# Altium schematic sheet 底层驱动板.SchDoc
size A3; SheetNumber: 1; SheetTotal: 1
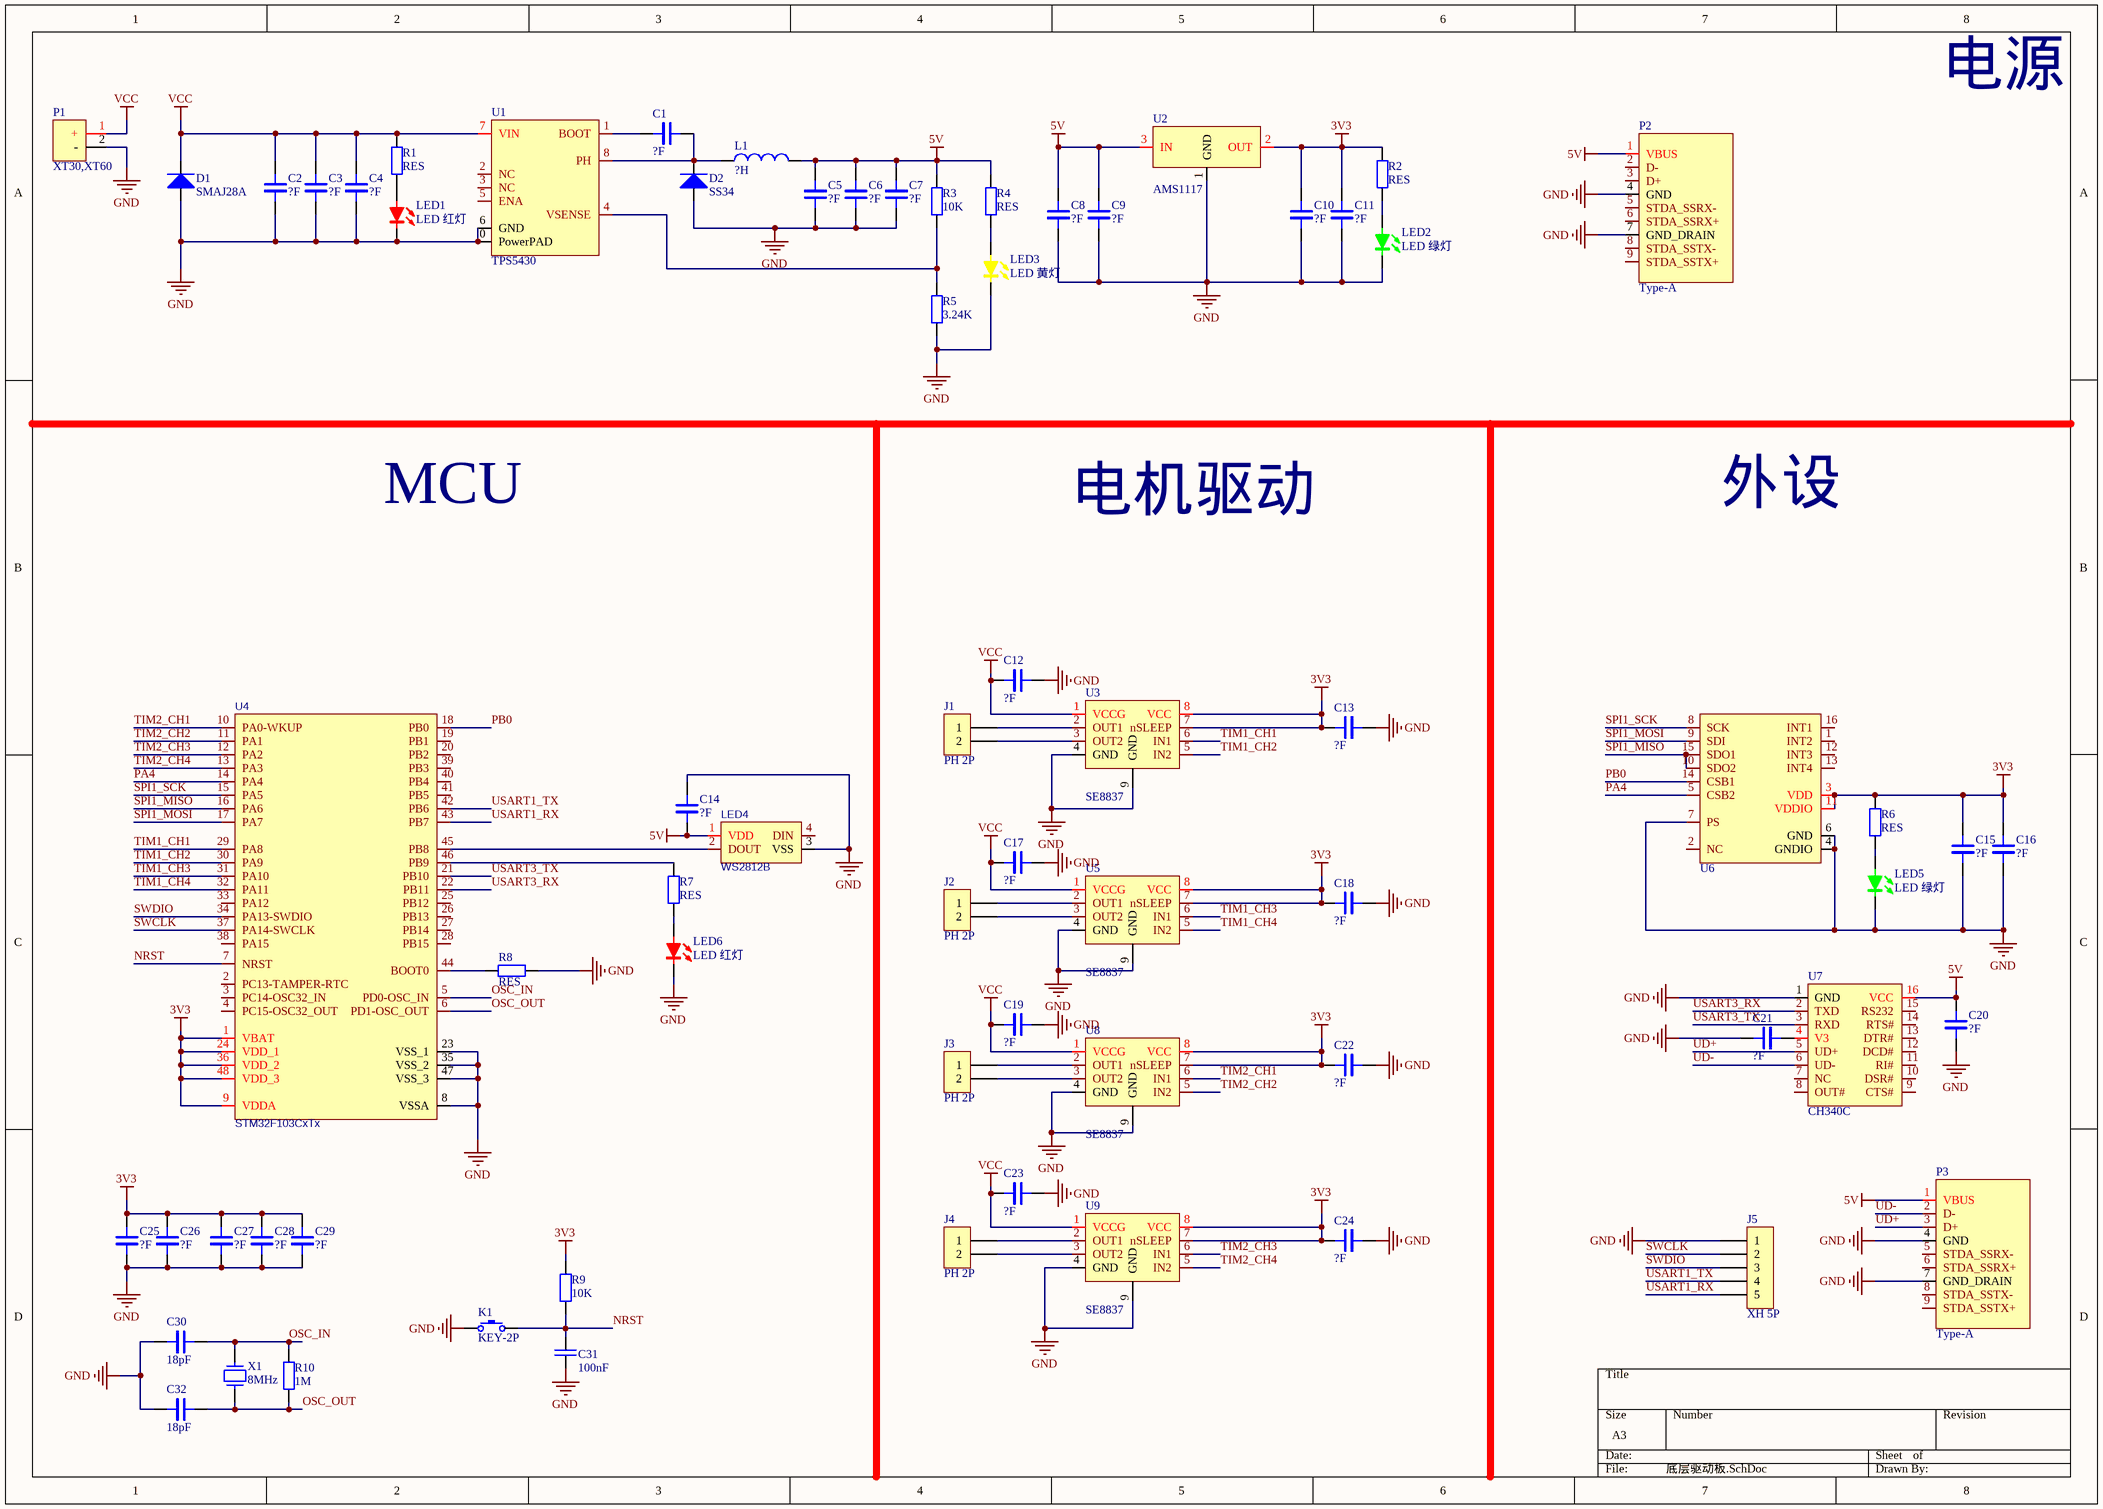
[diagram p0: 底层驱动板.SchDoc]

## Parts
C1  ?F  [C 0603]
C2  ?F  [C 1206]
C3  ?F  [C 1206]
C4  ?F  [C 0603]
C5  ?F  [C 1206]
C6  ?F  [C 1206]
C7  ?F  [C 0603]
C8  ?F  [C 1206]
C9  ?F  [C 1206]
C10  ?F  [C 1206]
C11  ?F  [C 1206]
C12  ?F  [C 1206]
C13  ?F  [C 0603]
C14  ?F  [C 0603]
C15  ?F  [C 0603]
C16  ?F  [C 0603]
C17  ?F  [C 1206]
C18  ?F  [C 0603]
C19  ?F  [C 1206]
C20  ?F  [C 0603]
C21  ?F  [C 0603]
C22  ?F  [C 0603]
C23  ?F  [C 1206]
C24  ?F  [C 0603]
C25  ?F  [C 0603]
C26  ?F  [C 0603]
C27  ?F  [C 0603]
C28  ?F  [C 0603]
C29  ?F  [C 0603]
C30  18pF  [C 0603]
C31  100nF  [C 0603]
C32  18pF  [C 0603]
D1  SMAJ28A  [SMA]
D2  SS34  [SMA]
J1  PH 2P  [PH2.0 S-W-2P]
J2  PH 2P  [PH2.0 S-W-2P]
J3  PH 2P  [PH2.0 S-W-2P]
J4  PH 2P  [PH2.0 S-W-2P]
J5  XH 5P  [XH2.54-5P_H]
K1  KEY-2P  [*SW-按键]
L1  ?H  [SMD 7*7*4]
LED1  LED 红灯  [LED 0603-R]
LED2  LED 绿灯  [LED 0603-G]
LED3  LED 黄灯  [LED 0603-Y]
LED4  WS2812B  [*WS2812B-3535]
LED5  LED 绿灯  [LED 0603-G]
LED6  LED 红灯  [LED 0603-R]
P1  XT30,XT60  [*XT30PW-M]
P2  Type-A  [*Type-A 母 弯插]
P3  Type-A  [*Type-A 母 弯插]
R1  RES  [R 0603]
R2  RES  [R 0603]
R3  10K  [R 0603]
R4  RES  [R 0603]
R5  3.24K  [R 0603]
R6  RES  [R 0603]
R7  RES  [R 0603]
R8  RES  [R 0603]
R9  10K  [R 0603]
R10  1M  [R 0603]
U1  TPS5430  [SOP8-EP]
U2  AMS1117  [SOT223]
U3  SE8837  [*DFN-8-EP]
U4  STM32F103CxTx  [LQFP48 7X7]
U5  SE8837  [*DFN-8-EP]
U6  BMI088  [*LGA-16]  (value not drawn)
U7  CH340C  [SOP16]
U8  SE8837  [*DFN-8-EP]
U9  SE8837  [*DFN-8-EP]
X1  8MHz  [XTAL SMD-2P]

## Nets
3V3: C10.2 C11.2 C13.2 C15.2 C16.2 C18.2 C22.2 C24.2 C25.2 C26.2 C27.2 C28.2 C29.2 R2.2 R6.2 R9.2 U2.2(OUT) U3.7(nSLEEP) U3.8(VCC) U4.1(VBAT) U4.9(VDDA) U4.24(VDD_1) U4.36(VDD_2) U4.48(VDD_3) U5.7(nSLEEP) U5.8(VCC) U6.3(VDD) U6.11(VDDIO) U8.7(nSLEEP) U8.8(VCC) U9.7(nSLEEP) U9.8(VCC)
5V: C5.2 C6.2 C7.2 C8.2 C9.2 C14.2 C20.2 L1.2 LED4.1(VDD) P2.1(VBUS) P3.1(VBUS) R3.2 R4.2 U2.3(IN) U7.16(VCC)
GND: C2.1 C3.1 C4.1 C5.1 C6.1 C7.1 C8.1 C9.1 C10.1 C11.1 C12.1 C13.1 C14.1 C15.1 C16.1 C17.1 C18.1 C19.1 C20.1 C21.1 C22.1 C23.1 C24.1 C25.1 C26.1 C27.1 C28.1 C29.1 C30.1 C31.2 C32.1 D1.1(A) D2.1 J5.1 K1.1 LED1.2(C) LED2.2(C) LED3.2(C) LED4.3(VSS) LED5.2(C) LED6.2(C) P1.2(-) P2.4(GND) P2.7(GND_DRAIN) P3.4(GND) P3.7(GND_DRAIN) R5.1 R8.2 U1.0(PowerPAD) U1.6(GND) U2.1(GND) U3.4(GND) U3.9(GND) U4.8(VSSA) U4.23(VSS_1) U4.35(VSS_2) U4.47(VSS_3) U5.4(GND) U5.9(GND) U6.4(GNDIO) U6.6(GND) U6.7(PS) U7.1(GND) U8.4(GND) U8.9(GND) U9.4(GND) U9.9(GND)
VCC: C2.2 C3.2 C4.2 C12.2 C17.2 C19.2 C23.2 D1.2(K) P1.1(+) R1.2 U1.7(VIN) U3.1(VCCG) U5.1(VCCG) U8.1(VCCG) U9.1(VCCG)
NRST: C31.1 K1.2 R9.1 U4.7(NRST)
OSC_IN: C30.2 R10.1 U4.5(PD0-OSC_IN) X1.1
OSC_OUT: C32.2 R10.2 U4.6(PD1-OSC_OUT) X1.2
PA4: U4.14(PA4) U6.5(CSB2)
PB0: U4.18(PB0) U6.14(CSB1)
SPI1_MISO: U4.16(PA6) U6.10(SDO2) U6.15(SDO1)
SPI1_MOSI: U4.17(PA7) U6.9(SDI)
SPI1_SCK: U4.15(PA5) U6.8(SCK)
SWCLK: J5.2 U4.37(PA14-SWCLK)
SWDIO: J5.3 U4.34(PA13-SWDIO)
TIM1_CH1: U3.6(IN1) U4.29(PA8)
TIM1_CH2: U3.5(IN2) U4.30(PA9)
TIM1_CH3: U4.31(PA10) U5.6(IN1)
TIM1_CH4: U4.32(PA11) U5.5(IN2)
TIM2_CH1: U4.10(PA0-WKUP) U8.6(IN1)
TIM2_CH2: U4.11(PA1) U8.5(IN2)
TIM2_CH3: U4.12(PA2) U9.6(IN1)
TIM2_CH4: U4.13(PA3) U9.5(IN2)
UD+: P3.3(D+) U7.5(UD+)
UD-: P3.2(D-) U7.6(UD-)
USART1_RX: J5.5 U4.43(PB7)
USART1_TX: J5.4 U4.42(PB6)
USART3_RX: U4.22(PB11) U7.2(TXD)
USART3_TX: U4.21(PB10) U7.3(RXD)
NetC1_1: C1.1 U1.1(BOOT)
NetC1_2: C1.2 D2.2 L1.1 U1.8(PH)
NetC21_2: C21.2 U7.4(V3)
NetJ1_1: J1.1 U3.2(OUT1)
NetJ1_2: J1.2 U3.3(OUT2)
NetJ2_1: J2.1 U5.2(OUT1)
NetJ2_2: J2.2 U5.3(OUT2)
NetJ3_1: J3.1 U8.2(OUT1)
NetJ3_2: J3.2 U8.3(OUT2)
NetJ4_1: J4.1 U9.2(OUT1)
NetJ4_2: J4.2 U9.3(OUT2)
NetLED1_1: LED1.1(A) R1.1
NetLED2_1: LED2.1(A) R2.1
NetLED3_1: LED3.1(A) R4.1
NetLED4_2: LED4.2(DOUT) U4.45(PB8)
NetLED5_1: LED5.1(A) R6.1
NetLED6_1: LED6.1(A) R7.2
NetR3_1: R3.1 R5.2 U1.4(VSENSE)
NetR7_1: R7.1 U4.46(PB9)
NetR8_1: R8.1 U4.44(BOOT0)

Not connected (* = marked no-connect by the designer): LED4 4(DIN); P2 2(D-) 3(D+) 5(STDA_SSRX-) 6(STDA_SSRX+) 8(STDA_SSTX-) 9(STDA_SSTX+); P3 5(STDA_SSRX-) 6(STDA_SSRX+) 8(STDA_SSTX-) 9(STDA_SSTX+); U1 2(NC) 3(NC) 5(ENA); U4 2(PC13-TAMPER-RTC) 3(PC14-OSC32_IN) 4(PC15-OSC32_OUT) 19(PB1) 20(PB2) 25(PB12) 26(PB13) 27(PB14) 28(PB15) 33(PA12) 38(PA15) 39(PB3) 40(PB4) 41(PB5); U6 1(INT2) 2(NC) 12(INT3) 13(INT4) 16(INT1); U7 7(NC) 8(OUT#) 9(CTS#) 10(DSR#) 11(RI#) 12(DCD#) 13(DTR#) 14(RTS#) 15(RS232)

## Notes on the sheet
- 电源
- MCU
- 外设
- 电机驱动

## Library data of the parts
C1-C30 C32 = CAP: Capacitor
C31 = Cap: Published: 8-Jun-2000; LatestRevisionDate: 17-Jul-2002; LatestRevisionNote: Re-released for DXP Platform.; PackageReference: RAD-0.3; Publisher: Altium Limited
D1 = SMAJ28A: TVS
D2 = SS34: 肖特基二极管; BOM_Manufacturer: SHOU HAN; BOM_Manufacturer Part: MSK12C02; Contributor: LCSC; BOM_Supplier: LCSC; BOM_Supplier Part: C431540; BOM_JLCPCB Part Class: Extended Part; spicePre: S; spiceSymbolName: MSK12C02
J1-J4 = PH 2P: Connector
J5 = XH 5P: Connector
K1 = KEY-2P: Key
L1 = Inductor: Code_IEC: 1005; Published: 8-Jun-2000; LatestRevisionDate: 17-Jul-2002; LatestRevisionNote: Re-released for DXP Platform.; PackageReference: 0402-A; Publisher: Altium Limited; Code_JEITA: 0402
LED1 LED6 = LED 红灯: LED
LED2 LED5 = LED 绿灯: LED
LED3 = LED 黄灯: LED
LED4 = WS2812B: 可控RGB灯; BOM_Manufacturer: Worldsemi; BOM_Manufacturer Part: WS2812B-3535; Contributor: LCSC; BOM_Supplier: LCSC; BOM_Supplier Part: C114583; BOM_JLCPCB Part Class: Extended Part; spicePre: L; spiceSymbolName: WS2812B-3535
P1 = XT: 电源接口
P2 P3 = Type-A: USB连接器
R1-R8 R10 = RES: Resistor
R9 = Res: Published: 8-Jun-2000; LatestRevisionDate: 17-Jul-2002; LatestRevisionNote: Re-released for DXP Platform.; PackageReference: AXIAL-0.4; Publisher: Altium Limited
U1 = TPS5450: DC-DC 降压芯片
U2 = AMS1117: LDO
U3 U5 U8 U9 = SE8837: 电机驱动芯片
U4 = STM32F103CxTx: STM32单片机; BOM_Manufacturer: STMicroelectronics; BOM_Manufacturer Part: STM32F103C8T6; timeStamp: 1455028086; BOM_Supplier: LCSC; BOM_Supplier Part: C8734; BOM_JLCPCB Part Class: Basic Part; spicePre: U; spiceSymbolName: STM32F103C8T6
U6 = BMI088: 陀螺仪
U7 = CH340C: USB转串口芯片; BOM_Manufacturer: SHOU HAN; BOM_Manufacturer Part: MSK12C02; Contributor: LCSC; BOM_Supplier: LCSC; BOM_Supplier Part: C431540; BOM_JLCPCB Part Class: Extended Part; spicePre: S; spiceSymbolName: MSK12C02
X1 = XTAL: Oscillator